# Altium schematic sheet 3.3V_and_1.8V_Load.SchDoc: 3.3V and 1.8V Discharge Load
size B; DocumentNumber: 39; SheetNumber: 39; SheetTotal: 46
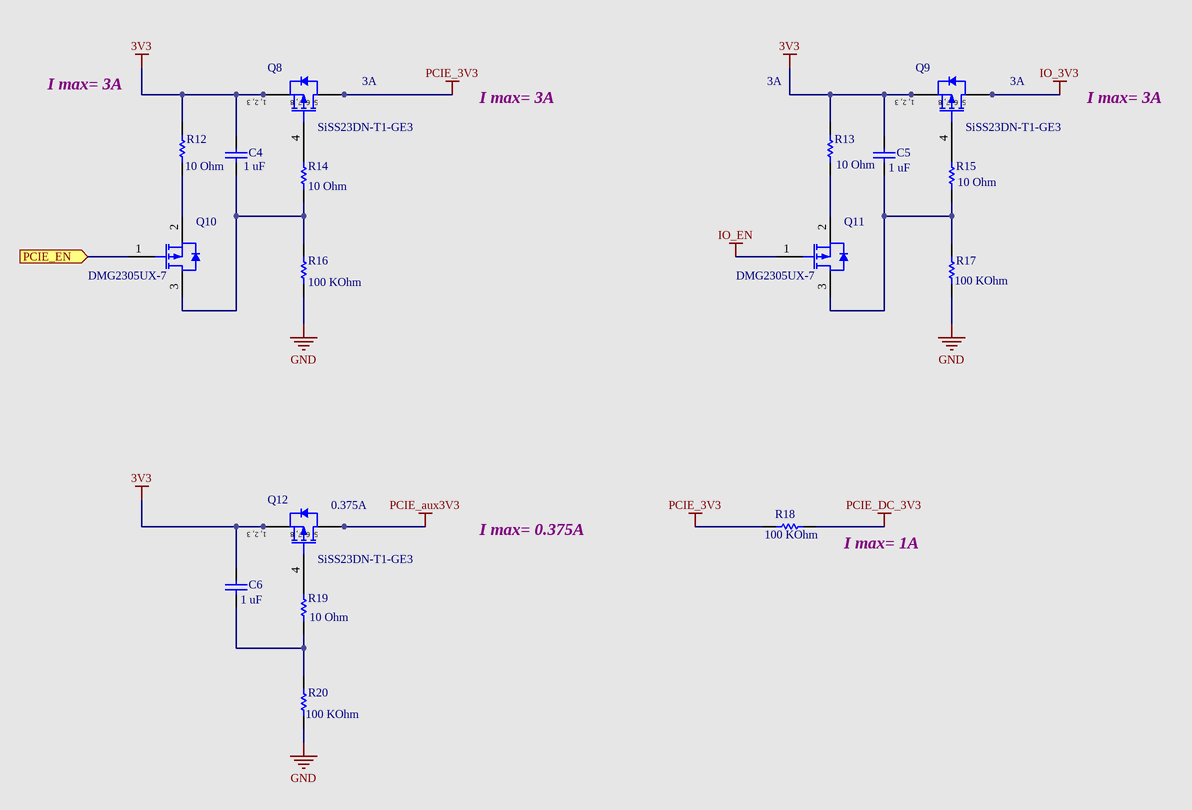
[diagram p0: 3.3V_and_1.8V_Load.SchDoc]

## Parts
C4  Capacitance: 1 uF  [CAPC1005X33X10LL5]  (hidden comment: CGB2A1X5R1E105K033BC)
C5  Capacitance: 1 uF  [CAPC1005X33X10LL5]  (hidden comment: CGB2A1X5R1E105K033BC)
C6  Capacitance: 1 uF  [CAPC1005X33X10LL5]  (hidden comment: CGB2A1X5R1E105K033BC)
Q8  SiSS23DN-T1-GE3  [VISH-PPAK1212-8S_V]
Q9  SiSS23DN-T1-GE3  [VISH-PPAK1212-8S_V]
Q10  DMG2305UX-7  [DIOD-SOT23-3_A_V]
Q11  DMG2305UX-7  [DIOD-SOT23-3_A_V]
Q12  SiSS23DN-T1-GE3  [VISH-PPAK1212-8S_V]
R12  Resistance: 10 Ohm  [RESC1005X40X25LL05T05]  (hidden comment: ERJ-2RKF10R0X)
R13  Resistance: 10 Ohm  [RESC1005X40X25LL05T05]  (hidden comment: ERJ-2RKF10R0X)
R14  Resistance: 10 Ohm  [RESC1005X40X25LL05T05]  (hidden comment: ERJ-2RKF10R0X)
R15  Resistance: 10 Ohm  [RESC1005X40X25LL05T05]  (hidden comment: ERJ-2RKF10R0X)
R16  Resistance: 100 KOhm  [RESC1005X40X25LL05T05]  (hidden comment: ERJ-2RKF1003X)
R17  Resistance: 100 KOhm  [RESC1005X40X25LL05T05]  (hidden comment: ERJ-2RKF1003X)
R18  Resistance: 100 KOhm  [RESC1005X40X25LL05T05]  (hidden comment: ERJ-2RKF1003X)
R19  Resistance: 10 Ohm  [RESC1005X40X25LL05T05]  (hidden comment: ERJ-2RKF10R0X)
R20  Resistance: 100 KOhm  [RESC1005X40X25LL05T05]  (hidden comment: ERJ-2RKF1003X)

## Ports
PCIE_EN (in)

## Nets
3V3: C4.2 C5.2 C6.2 Q8.1(S) Q8.2(S) Q8.3(S) Q9.1(S) Q9.2(S) Q9.3(S) Q12.1(S) Q12.2(S) Q12.3(S) R12.2 R13.2
GND: R16.1 R17.1 R20.1
IO_3V3: Q9.5(D) Q9.6(D) Q9.7(D) Q9.8(D)
IO_EN: Q11.1(GATE)
PCIE_3V3: Q8.5(D) Q8.6(D) Q8.7(D) Q8.8(D) R18.2
PCIE_aux3V3: Q12.5(D) Q12.6(D) Q12.7(D) Q12.8(D)
PCIE_DC_3V3: R18.1
PCIE_EN: Q10.1(GATE) ; port PCIE_EN
NetC4_1: C4.1 Q10.3(DRAIN) R14.1 R16.2
NetC5_1: C5.1 Q11.3(DRAIN) R15.1 R17.2
NetC6_1: C6.1 R19.1 R20.2
NetQ8_4: Q8.4(G) R14.2
NetQ9_4: Q9.4(G) R15.2
NetQ10_2: Q10.2(SOURCE) R12.1
NetQ11_2: Q11.2(SOURCE) R13.1
NetQ12_4: Q12.4(G) R19.2

## Notes on the sheet
- I max= 3A
- (near Q8) 3A
- 3A
- (near Q9) 3A
- (near Q12) 0.375A
- I max= 0.375A
- (near R18) I max= 1A
- Title
- Size:
- Date:
- B
- Number:
- Time:
- Revision:
- Sheet
- of
- File:
- (in symbol CMP-1709-00001-3) 1, 2, 3; 5, 6, 7, 8

## Library data of the parts
C4-C6 = CMP-1663-00006-2: Chip Capacitor, 1 uF, +/- 10%, 25 V, -55 to 85 degC, 0402 (1005 Metric), RoHS, Tape and Reel; Tolerance: 10%; PackageDescription: 2-Pin Surface Mount Device, Body 1 x 0.5 mm; PartNumber: CGB2A1X5R1E105K033BC; Case Code (Metric): 1005; DatasheetVersion: 04/2015; RoHSCompliant: True; Max Operating Temperature: 85 degC; ComponentLink2URL: https://product.tdk.com/info/en/catalog/datasheets/mlcc_commercial_lowprofile_en.pdf; Package Quantity: 1; Width: 0.02 inch; Case/Package: 0402; Case Code (Imperial): 0402; Packaging: Tape and Reel; Length: 0.039 inch; Min Operating Temperature: -55 degC; Mounting Technology: Surface Mount; ComponentLink2Description: Datasheet; ComponentLink1URL: http://www.tdk.com/; ComponentLink1Description: Manufacturer URL
Q8 Q9 Q12 = CMP-1709-00001-3: P-Channel MOSFET, 20 V, -50 to 150 degC, 8-Pin SMD (PPAK1212-8S), RoHS, Tape and Reel; ComponentLink1URL: http://www.vishay.com/; PackageVersion: Rev. A, 03/2012; PackageDescription: 8-Pin Surface Mount Device, Body 3.3 x 3.3 mm, Pitch 0.66 mm; ComponentLink3Description: Package Specification; ComponentLink2Description: Datasheet; ComponentLink2URL: http://www.vishay.com/docs/62852/siss23dn.pdf; ComponentLink1Description: Manufacturer URL; DatasheetVersion: Rev. A; ComponentLink3URL: http://www.vishay.com/docs/63919/caseoutl.pdf; Mounting Technology: Surface Mount; PartNumber: SiSS23DN-T1-GE3
Q10 Q11 = CMP-1693-00002-1: P-Channel Enhancement Mode MOSFET, 20 V, -55 to 150 degC, 3-Pin SOT23, RoHS, Tape and Reel; Manufacturer: Diodes Inc; PackageReference: SOT23-3; PartNumber: DMG2305UX-7; PackageDescription: 3-Pin Small Outline Transistor, Body 2.9 x 1.3 mm, Pitch 0.915 mm; ComponentLink1Description: Manufacturer URL; Mounting Technology: Surface Mount; DatasheetVersion: Rev. 5-2; ComponentLink1URL: http://www.diodes.com/; ComponentLink2URL: http://www.diodes.com/_files/datasheets/DMG2305UX.pdf; ComponentLink2Description: Datasheet
R12-R15 R19 = CMP-2002-00622-3: Chip Resistor, 10 Ohm, +/- 1%, 100 mW, -55 to 155 degC, 0402 (1005 Metric), RoHS, Tape and Reel; Manufacturer: Basic Passives; Voltage Rating: 50 V; Power Rating: 100 mW; Case\/Package: 0402; RoHSCompliant: true; PartNumber: ERJ-2RKF10R0X; Case Code (Imperial): 0402; Package Quantity: 10000; ComponentLink1Description: Manufacturer URL; Width: 0.5 mm; Height: 0.35 mm; Tolerance: 1%; REACH SVHC: Yes; Case Code (Metric): 1005; Max Operating Temperature: 155 degC; PackageDescription: 2-Pin Surface Mount Device, Body 1 x 0.5 mm; Mounting Technology: Surface Mount; Min Operating Temperature: -55 degC; Mount: Surface Mount; Packaging: Tape and Reel; ComponentLink1URL: http://www.panasonic.com/; Length: 1 mm; ComponentLink2Description: Datasheet; Pins: 2; PackageReference: 0402; Radiation Hardening: No; ComponentLink2URL: http://industrial.panasonic.com/cdbs/www-data/pdf/RDA0000/AOA0000C86.pdf; DatasheetVersion: 04/2015
R16-R18 R20 = CMP-2002-00608-3: Chip Resistor, 100 KOhm, +/- 1%, 100 mW, -55 to 155 degC, 0402 (1005 Metric), RoHS, Tape and Reel; Manufacturer: Basic Passives; Voltage Rating: 50 V; Power Rating: 100 mW; Case\/Package: 0402; Height: 0.35 mm; ComponentLink1Description: Manufacturer URL; Packaging: Tape and Reel; Min Operating Temperature: -55 degC; RoHSCompliant: true; PackageDescription: 2-Pin Surface Mount Device, Body 1 x 0.5 mm; Mount: Surface Mount; Package Quantity: 10000; Max Operating Temperature: 155 degC; ComponentLink1URL: http://www.panasonic.com/; Tolerance: 1%; Mounting Technology: Surface Mount; PartNumber: ERJ-2RKF1003X; Case Code (Metric): 1005; Case Code (Imperial): 0402; REACH SVHC: Yes; Length: 1 mm; Width: 0.5 mm; DatasheetVersion: 04/2015; Pins: 2; ComponentLink2Description: Datasheet; ComponentLink2URL: http://industrial.panasonic.com/cdbs/www-data/pdf/RDA0000/AOA0000C86.pdf; PackageReference: 0402; Radiation Hardening: No